# Altium schematic sheet LCD.SchDoc
size B; SheetNumber: 1; SheetTotal: 1
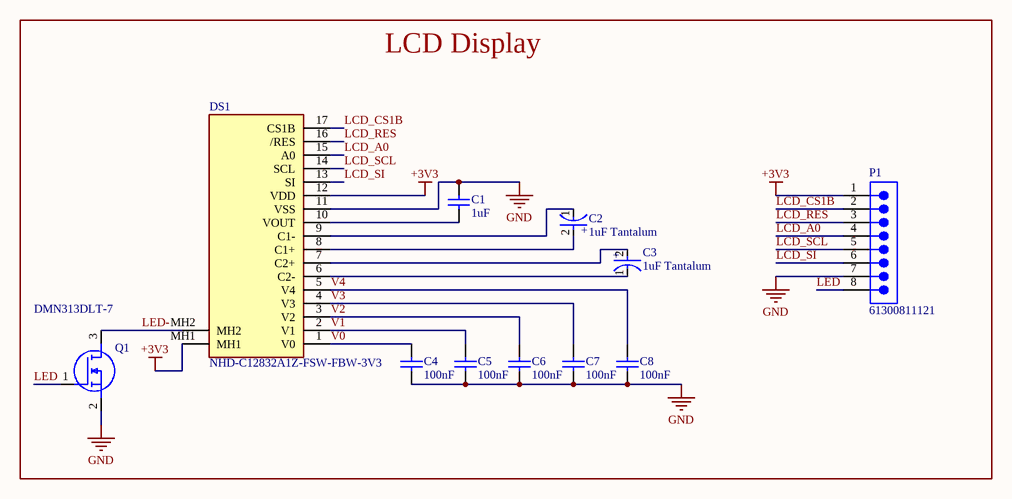
[diagram p0: LCD.SchDoc]

## Parts
C1  1uF  [CAPC1206(3216)130_N]
C2  1uF Tantalum  [FP-293DB-MFG]
C3  1uF Tantalum  [FP-293DB-MFG]
C4  100nF  [CAPC1608X87X45LL20T05]
C5  100nF  [CAPC1608X87X45LL20T05]
C6  100nF  [CAPC1608X87X45LL20T05]
C7  100nF  [CAPC1608X87X45LL20T05]
C8  100nF  [CAPC1608X87X45LL20T05]
DS1  NHD-C12832A1Z-FSW-FBW-3V3  [NHDC12832A1ZFSWFBW3V3]
P1  61300811121  [61300811121]
Q1  DMN313DLT-7  [SOT50P160X90-3N]

## Blocks framed on the sheet
LCD Display: C1-C8 DS1 P1 Q1

## Nets
+3V3: DS1.12(VDD) DS1.MH1 P1.1
GND: C1.2 C4.1 C5.1 C6.1 C7.1 C8.1 DS1.11(VSS) P1.7 Q1.2(S)
LCD_A0: DS1.15(A0) P1.4
LCD_CS1B: DS1.17(CS1B) P1.2
LCD_RES: DS1.16(/RES) P1.3
LCD_SCL: DS1.14(SCL) P1.5
LCD_SI: DS1.13(SI) P1.6
LED: P1.8 Q1.1(G)
LED-: DS1.MH2 Q1.3(D)
V0: C4.2 DS1.1(V0)
V1: C5.2 DS1.2(V1)
V2: C6.2 DS1.3(V2)
V3: C7.2 DS1.4(V3)
V4: C8.2 DS1.5(V4)
NetC1_1: C1.1 DS1.10(VOUT)
NetC2_1: C2.1(C) DS1.9(C1-)
NetC2_2: C2.2(A) DS1.8(C1+)
NetC3_1: C3.1(C) DS1.6(C2-)
NetC3_2: C3.2(A) DS1.7(C2+)

## Notes on the sheet
- (in symbol CMP-00030-39694356-1) +

## Library data of the parts
C1 = CMP-1037-04671-1: CAP 1uF 10V ±5% 1206 (3216 Metric) Thickness 1.3mm SMD; Case-EIA: 1206; Tolerance: Â±5%; Case-Metric: 3216; Value: 1uF; Technology: SMT; Rated Voltage: 10 V; Max Thickness: 1.3 mm
C2 C3 = CMP-00030-39694356-1: 293D105X9050B2TE3 Cap Tant Solid 1uF 50V B CASE 10% (3.5 X 2.8 X 1.9mm) Inward L SMD 3528-21 6.7 Ohm 125C T/R; Leakage Current: 500nA; Ripple Current: 110mA; Dissipation Factor: 4%; Polarity: Polar; Q Factor: 4; Capacitance: 1µF; ESR (Equivalent Series Resistance): 6.7Ω; Voltage Rating (DC): 5V; Max Operating Temperature: 125°C; Length: 3.5mm; Tolerance: 10%; NexarPartId: 39694356; Width: 2.794mm; Features: General Purpose; Depth: 2.8mm; Voltage: 50V; REACH SVHC: Unknown; Packaging: Cut Tape; Dielectric Material: Tantalum; Voltage Rating: 50V; Termination: SMD/SMT; Lead Free: Lead Free; Height: 1.9mm; Case/Package: 1411; Height - Seated (Max): 2.1082mm; Radiation Hardening: No; Min Operating Temperature: -55°C; Schedule B: 8532210050, 8532210050; Mount: Surface Mount; Case Code (Imperial): 1411; Number of Pins: 2; Case Code (Metric): 3528; RoHS: Compliant
C4-C8 = CMP-2006-00001-1: Ceramic 100nF X7R 16V 5%; Part Number: C0603X104J4RACTU; Manufacturer: Kemet
DS1 = NHD-C12832A1Z-FSW-FBW-3V3: Display; Manufacturer_Name: Newhaven Display; Datasheet Link: https://www.newhavendisplay.com/specs/NHD-C12832A1Z-FSW-FBW-3V3.pdf; Height: 4.3mm; Manufacturer_Part_Number: NHD-C12832A1Z-FSW-FBW-3V3; Mouser Part Number: 763-C12832A1ZFSWFBW3; Mouser Price/Stock: https://www.mouser.co.uk/ProductDetail/Newhaven-Display/NHD-C12832A1Z-FSW-FBW-3V3?qs=Vb5qD4CGh4nSmlh9l2%252Byrw%3D%3D
P1 = CMP-1502-01076-3: NexarPartId: 32855533; Connector Type: Male Pin; Number of Contacts: 8; Voltage Rating: 250V; Current Rating: 3A; Contact Resistance: 20mΩ; Pitch: 2.54mm; Gender: Male; Termination: Solder; Contact Material: Copper; Mount: Through Hole; Lead Pitch: 2.54mm; Number of Positions: 8; Operating Supply Voltage: 250V; Number of Pins: 8; Max Operating Temperature: 105°C; Height: 8.54mm; REACH SVHC: Unknown; Number of Rows: 1; Packaging: Bulk; Contact Plating: Gold; Contact Mating Length: 5.9944mm; Orientation: Vertical; RoHS: Compliant; Color: Black; Min Operating Temperature: -40°C
Q1 = DMN313DLT-7: MOSFET (N-Channel); Manufacturer_Name: Diodes Incorporated; Datasheet Link: https://www.diodes.com//assets/Datasheets/DMN313DLT.pdf; Height: 0.9mm; Manufacturer_Part_Number: DMN313DLT-7; Mouser Part Number: 621-DMN313DLT-7; Mouser Price/Stock: https://www.mouser.co.uk/ProductDetail/Diodes-Incorporated/DMN313DLT-7?qs=dOK1vf2izjtPPiEYvL6qdA%3D%3D; Arrow Part Number: DMN313DLT-7; Arrow Price/Stock: https://www.arrow.com/en/products/dmn313dlt-7/diodes-incorporated?region=europe